# EAGLE board ESP32 Display 2.4 inch V1.0 (EAGLE 9.6.2), part 1 of 2
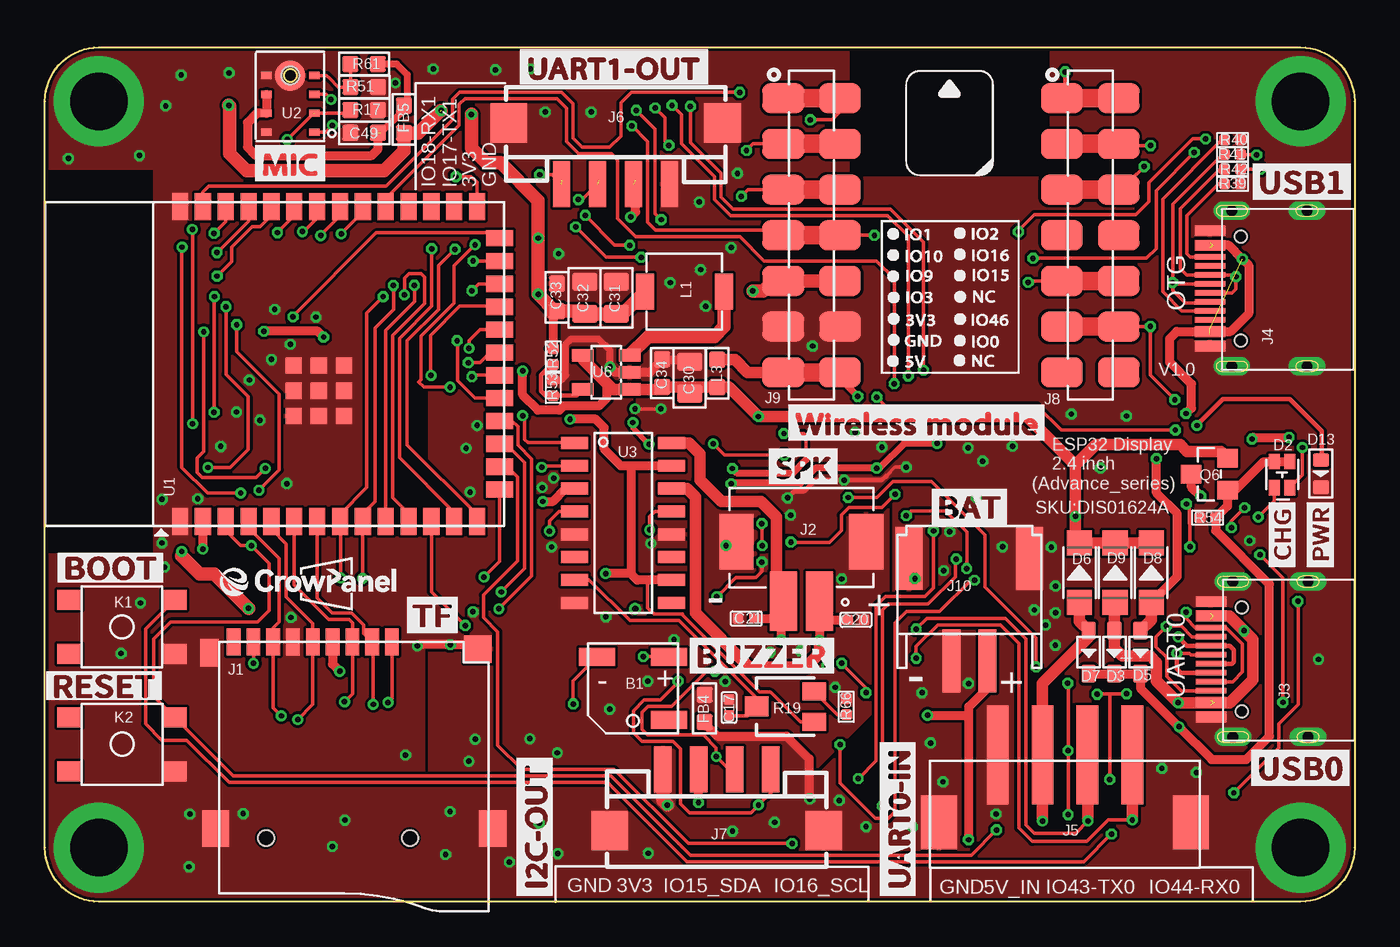
[diagram p5: board, top side]
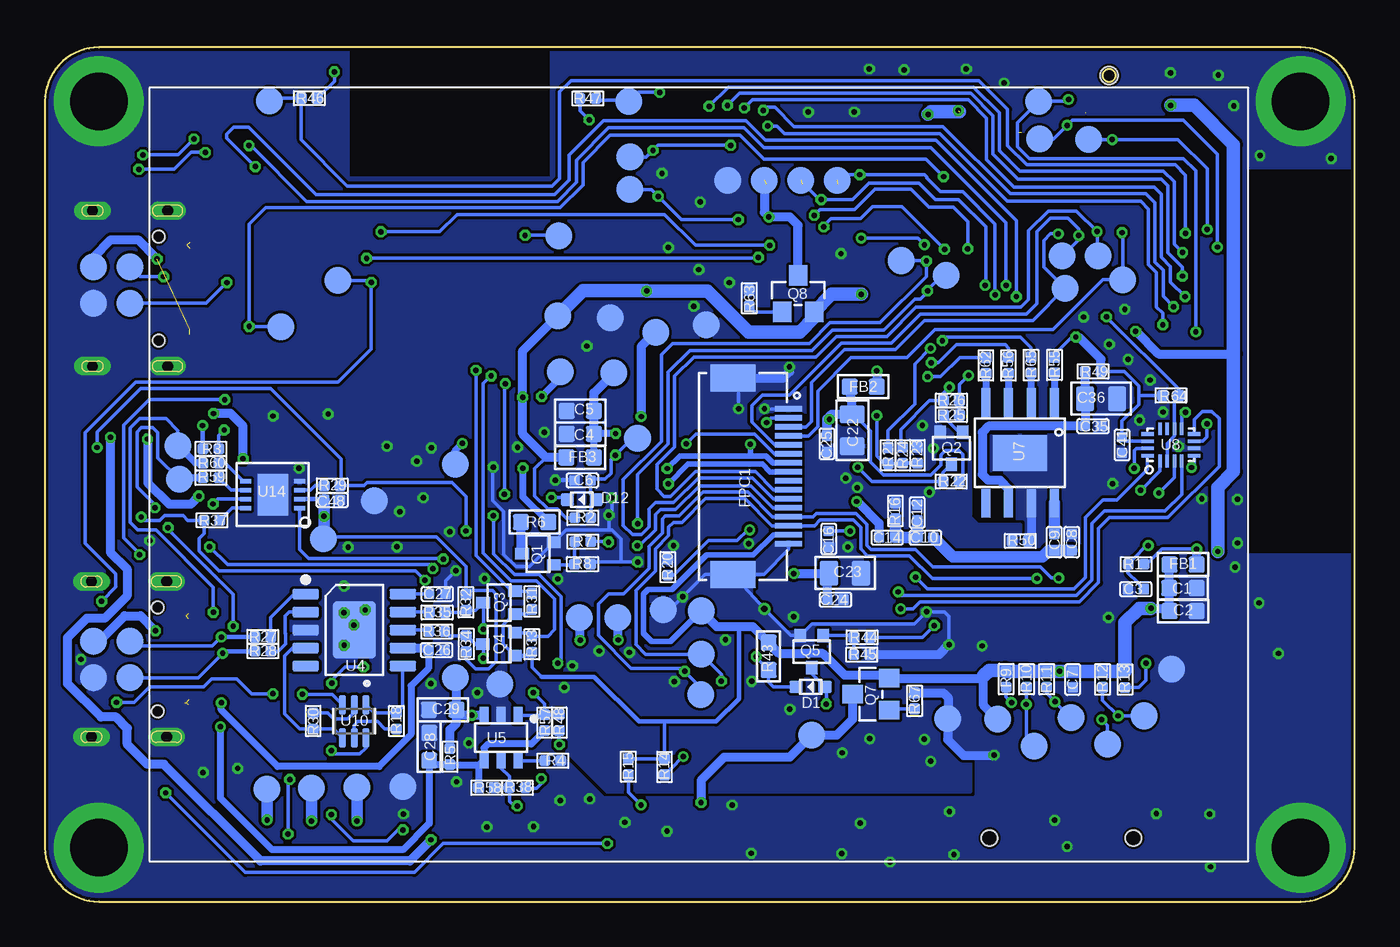
[diagram p6: board, bottom side, seen from below]

Size 72.8 x 47.5 mm. Coordinates in mm from the lower left corner, seen from the top.
Outline: 69.8,0 3,0 arc-90 0,3 0,44.5 arc-90 3,47.5 69.8,47.5 arc-90 72.8,44.5 72.8,3 arc-90 69.8,0
Copper layers (1*16): Top 0.035mm / dielectric 1.5mm / Bottom 0.035mm
Design rules "default": minimum track width 8mil, minimum drill 0.3mm, track to track 6mil, track to pad 6mil, pad to pad 4mil, via to via 6mil, smd to smd 6mil, copper to edge 6mil, drill to drill 4mil, minimum pad ring 6mil, minimum via ring 6mil, stop-mask expansion 4mil, vias tented up to drill 100mil, thermal gap 0mil
tRestrict: area 44.7,40.3 to 55.8,47.4; area 0,19.4 to 6,40.7
bRestrict: area 44.7,40.3 to 55.8,47.4; area 0,19.4 to 6,40.7

## Footprints (pad centres in the part's own frame; a part is rotated, then mirrored left to right if it is on the bottom)
BEEP_5025 = smd 2 x 1: 1 -2,-1.75; 2 2,-1.75; 3 -2,1.75
C0603 = smd 0.889 x 0.889: 1 -0.762,0; 2 0.762,0
C0402 = smd 0.6 x 0.6: 1 -0.45,0; 2 0.45,0
C0805 = smd 1.016 x 1.397: 1 -0.889,0; 2 0.889,0
D_SOD523 = smd 0.762 x 0.7: + -0.8,0; - 0.8,0
LED_KT-0603RYG = smd 0.85 x 0.6: 1 0.725,-0.425; 2 0.725,0.425; 3 -0.725,-0.425; 4 -0.725,0.425
D_SOD323 = smd 1 x 0.8: + -1.2,0; - 1.2,0
D_SOD123FL = smd 1.397 x 1.397: + -1.651,0; - 1.651,0
LED0603 = smd 0.762 x 0.889: + -0.762,0; - 0.762,0
L0603 = smd 0.889 x 0.889: 1 -0.762,0; 2 0.762,0
FPC-0.5MM-16P-SMD = smd 0.3 x 1.5: 1 -3.75,1.55; 2 -3.25,1.55; 3 -2.75,1.55; 4 -2.25,1.55; 5 -1.75,1.55; 6 -1.25,1.55; 7 -0.75,1.55; 8 -0.25,1.55; 9 0.25,1.55; 10 0.75,1.55; 11 1.25,1.55; 12 1.75,1.55; 13 2.25,1.55; 14 2.75,1.55; 15 3.25,1.55; 16 3.75,1.55 | smd 1.5 x 2.5: 17 5.45,-1.55; 18 -5.45,-1.55
9P-SMD-W/-RING = smd 1.524 x 0.762: 1 0,4.4; 2 0,3.3; 3 0,2.2; 4 0,1.1; 5 0,0; 6 0,-1.1; 7 0,-2.2; 8 0,-3.3; 9 0,-4.4 | smd 1.524 x 1.016: G1 0.6,-5.746 | smd 2.032 x 1.524: G2 10.373,-5.4; G3 10.373,10 | smd 1.524 x 1.524: G4 0.392,9.181 | hole 0.889: 10.9,-2.6; 10.9,5.4
CONN-TH_2P-P2.00_XUNPU_WAFER-PH2.0-2PLB = smd 1.5 x 3.3: 1 -1,1.65; 2 1,1.65 | smd 1.9 x 3.1: 3 3.6,-1.65; 4 -3.6,-1.65
USB-3.0TYPEC-SMD = smd 0.3 x 1.7: A1 -3.35,0.5; A4 -2.55,0.5; A5 -1.25,0.5; A6 -0.25,0.5; A7 0.25,0.5; A8 1.25,0.5; A9 2.55,0.5; A12 3.35,0.5; B1 3.05,0.5; B4 2.25,0.5; B5 1.75,0.5; B6 0.75,0.5; B7 -0.75,0.5; B8 -1.75,0.5; B9 -2.25,0.5; B12 -3.05,0.5 | drill 0.6 pad 1.016 long: P$1 -4.325,-0.72; P$2 4.325,-0.72; P$3 -4.325,-4.9; P$4 4.325,-4.9 | hole 0.68: -2.89,-1.22; 2.89,-1.22
XH2.54-4P-SMD = smd 1.2 x 5.5: 1 -3.75,-1.875; 2 -1.25,-1.875; 3 1.25,-1.875; 4 3.75,-1.875 | smd 2 x 3: 5 -7,1.875; 6 7,1.875
CONNECTOR_4P-SMD-2.0 = smd 0.965 x 2.54: 1 -3,0; 2 -1,0; 3 1,0; 4 3,0 | smd 2.032 x 2.184: SS1 -5.946,3.4; SS2 5.946,3.4
H7-2.54-18.28X2.5X5MM = smd 1.65 x 2.3: 1 -7.62,-1.58; 1-1 -7.62,1.58; 2 -5.08,-1.58; 2-2 -5.08,1.58; 3 -2.54,-1.58; 3-3 -2.54,1.58; 4 0,-1.58; 4-4 0,1.58; 5 2.54,-1.58; 5-5 2.54,1.58; 6 5.08,-1.58; 6-6 5.08,1.58; 7 7.62,-1.58; 7-7 7.62,1.58
PH2.0WT-2PIN = smd 1 x 3.5: P$1 -1,0; P$2 1,0 | smd 1.5 x 3.5: P$3 -3.35,-5.7; P$4 3.35,-5.7
THO-M3.2*5MM-HOLE = drill 3.2 pad 5: P$1 0,0
KEY-4.5X4.5-SMD = smd 1.35 x 1.1: 1 -2.925,1.5; 2 -2.925,-1.5; 3 2.925,-1.5; 4 2.925,1.5
L0420 = smd 2 x 1: 1 0,2.2; 2 0,-2.2
TEST_PAD-1.5MM = smd 1.5 x 1.5: P$1 0,0
MOS_SOT323 = smd 0.635 x 0.762: 1 -0.635,-0.889; 2 0.635,-0.889; 3 0,0.889
PMOS_SOT23 = smd 1.016 x 1.143: 1 -0.889,-1.016; 2 0.889,-1.016; 3 0,1.016
R0402 = smd 0.635 x 0.635: 1 -0.445,0; 2 0.445,0
R0603-SP = smd 0.889 x 0.889: 1 -0.762,0; 2 0.762,0
3P-SMD-SQUA-3.6X3.3 = smd 1 x 1.3: 1 -0.85,-1.6; 3 0.85,-1.6 | smd 1.1 x 1.3: 2 0,1.6
ESP32-S3-WROOM-1-SMD41 = smd 1.5 x 0.9: 1 -8.75,5.26; 2 -8.75,3.99; 3 -8.75,2.72; 4 -8.75,1.45; 5 -8.75,0.18; 6 -8.75,-1.09; 7 -8.75,-2.36; 8 -8.75,-3.63; 9 -8.75,-4.9; 10 -8.75,-6.17; 11 -8.75,-7.44; 12 -8.75,-8.71; 13 -8.75,-9.98; 14 -8.75,-11.25; 27 8.75,-11.25; 28 8.75,-9.98; 29 8.75,-8.71; 30 8.75,-7.44; 31 8.75,-6.17; 32 8.75,-4.9; 33 8.75,-3.63; 34 8.75,-2.36; 35 8.75,-1.09; 36 8.75,0.18; 37 8.75,1.45; 38 8.75,2.72; 39 8.75,3.99; 40 8.75,5.26 | smd 0.9 x 1.5: 15 -6.985,-12.5; 16 -5.715,-12.5; 17 -4.445,-12.5; 18 -3.175,-12.5; 19 -1.905,-12.5; 20 -0.635,-12.5; 21 0.635,-12.5; 22 1.905,-12.5; 23 3.175,-12.5; 24 4.445,-12.5; 25 5.715,-12.5; 26 6.985,-12.5 | smd 0.9 x 0.9: 41 -2.9,-1.06; 42 -1.5,-1.06; 43 -0.1,-1.06; 44 -2.9,-2.46; 45 -1.5,-2.46; 46 -0.1,-2.46; 47 -2.9,-3.86; 48 -1.5,-3.86; 49 -0.1,-3.86
ICS_43432_IIS_INMP441 = smd 0.6 x 0.4: 1 1.203,-0.991; 2 1.203,0.059; 3 1.203,1.109; 4 1.203,2.159; 6 -1.457,2.159; 7 -1.457,1.109; 8 -1.457,0.059; 9 -1.457,-0.991 | smd 1.7 x 1.7: 5 -0.127,2.159 | hole 1: -0.127,2.159
SOP-16 = smd 0.66 x 1.5: 1 -4.445,-2.7; 2 -3.175,-2.7; 3 -1.905,-2.7; 4 -0.635,-2.7; 5 0.635,-2.7; 6 1.905,-2.7; 7 3.175,-2.7; 8 4.445,-2.7; 9 4.445,2.7; 10 3.175,2.7; 11 1.905,2.7; 12 0.635,2.7; 13 -0.635,2.7; 14 -1.905,2.7; 15 -3.175,2.7; 16 -4.445,2.7
ESOP-10-EP-150MIL = smd 1.5 x 0.6: 1 -2.7,2; 2 -2.7,1; 3 -2.7,0; 4 -2.7,-1; 5 -2.7,-2; 6 2.7,-2; 7 2.7,-1; 8 2.7,0; 9 2.7,1; 10 2.7,2 | smd 2.4 x 3.2: EP 0,0
SOT23-6L = smd 0.5 x 0.9: 1 -0.961,-1.212; 2 -0.011,-1.212; 3 0.94,-1.212; 4 0.94,1.288; 5 -0.011,1.288; 6 -0.961,1.288
IC_SOT23-5 = smd 0.69 x 1.2: 1 -0.95,-1.3; 2 0,-1.3; 3 0.95,-1.3; 4 0.95,1.3; 5 -0.95,1.3
NS4168-ESOP-8 = smd 1.6 x 0.5: 1 -2.8,1.905; 2 -2.8,0.635; 3 -2.8,-0.635; 4 -2.8,-1.905; 5 2.8,-1.905; 6 2.8,-0.635; 7 2.8,0.635; 8 2.8,1.905 | smd 2 x 3: 9 0,0
IC_SGM3799_TQFN2.6X1.8_16L = smd 0.2 x 0.7: 1 -0.6,-0.9; 2 -0.2,-0.9; 3 0.2,-0.9; 4 0.6,-0.9; 9 0.6,0.9; 10 0.2,0.9; 11 -0.2,0.9; 12 -0.6,0.9 | smd 0.7 x 0.2: 5 1.3,-0.6; 6 1.3,-0.2; 7 1.3,0.2; 8 1.3,0.6; 13 -1.3,0.6; 14 -1.3,0.2; 15 -1.3,-0.2; 16 -1.3,-0.6
SOP65P210X100-6N = smd 1.09 x 0.4: 1 -0.92,0.65; 2 -0.92,0; 3 -0.92,-0.65; 4 0.92,-0.65; 5 0.92,0; 6 0.92,0.65
DFN8 = smd 0.61 x 0.25: 1 -1.5,0.75; 2 -1.5,0.25; 3 -1.5,-0.25; 4 -1.5,-0.75; 5 1.5,-0.75; 6 1.5,-0.25; 7 1.5,0.25; 8 1.5,0.75 | smd 1.7 x 2.3: P$9 0,0

## Placement (x,y rotation side)
B1  BEEP_5025  [BEEP_5025]  32.69,11.85 180 top
C1  10uF/0603  [C0603]  9.54,17.44 180 bottom
C2  100nF/0603  [C0603]  9.53,16.15 180 bottom
C3  1uF  [C0402]  12.16,17.37 0 bottom
C4  100nF/0603  [C0603]  43.04,26 0 bottom
C5  100nF/0603  [C0603]  43.04,27.28 0 bottom
C6  1uF  [C0402]  42.92,23.42 0 bottom
C7  1uF  [C0402]  15.67,12.35 90 bottom
C8  1nF  [C0402]  15.72,19.99 270 bottom
C9  10uF  [C0402]  16.69,19.98 270 bottom
C10  1uF  [C0402]  23.85,20.24 0 bottom
C12  100nF/NC  [C0402]  24.31,21.63 270 bottom
C14  100nF  [C0402]  25.98,20.24 0 bottom
C16  4.7uF  [C0402]  29.23,20.16 90 bottom
C17  100nF  [C0402]  38.03,10.79 270 top
C20  1nF  [C0402]  45.09,15.67 180 top
C21  1nF  [C0402]  38.98,15.74 0 top
C22  22uF/0805  [C0805]  27.92,26.21 90 bottom
C23  22uF/0805  [C0805]  28.32,18.27 180 bottom
C24  100nF  [C0402]  28.86,16.79 0 bottom
C25  100nF  [C0402]  29.33,25.45 270 bottom
C26  1uF  [C0402]  51.03,13.98 180 bottom
C27  1uF  [C0402]  50.99,17.1 180 bottom
C28  1uF/0603  [C0603]  51.44,8.62 270 bottom
C29  10uF/0603  [C0603]  50.69,10.67 0 bottom
C30  22uF/0805  [C0805]  35.84,29.13 270 top
C31  22uF/0805  [C0805]  31.77,33.56 270 top
C32  22uF/0805  [C0805]  30,33.56 270 top
C33  1uF/0603  [C0603]  28.46,33.59 270 top
C34  1uF/0603  [C0603]  34.31,29.39 270 top
C35  100nF  [C0402]  14.54,26.44 0 bottom
C36  47uF/0805  [C0805]  14.08,27.96 0 bottom
C41  1uF  [C0402]  12.93,25.39 90 bottom
C48  1uF  [C0402]  56.83,22.33 180 bottom
C49  100nF  [C0603]  17.75,42.74 0 top
D1  B5819WT  [D_SOD523]  30.24,11.94 180 bottom
D2  KT-0603RYG  [LED_KT-0603RYG]  68.77,23.75 90 top
D3  1N5817WS  [D_SOD323]  59.45,13.87 270 top
D5  1N5817WS  [D_SOD323]  60.9,13.87 270 top
D6  DSS34  [D_SOD123FL]  57.51,18.29 90 top
D7  1N5817WS  [D_SOD323]  58.02,13.87 270 top
D8  DSS34  [D_SOD123FL]  61.5,18.29 90 top
D9  DSS34  [D_SOD123FL]  59.49,18.29 90 top
D12  B5819WT  [D_SOD523]  42.96,22.35 180 bottom
D13  Red  [LED0603]  70.93,23.8 270 top
FB1  0R/800mA  [L0603]  9.53,18.74 0 bottom
FB2  0R/600mA  [L0603]  27.32,28.63 180 bottom
FB3  0R/800mA  [L0603]  43.05,24.7 0 bottom
FB4  0R/600mA  [L0603]  36.67,10.75 270 top
FB5  0R/800mA  [L0603]  19.95,43.49 90 top
FPC1  TFT-2.4-SPI-16P  [FPC-0.5MM-16P-SMD]  33.01,23.65 270 bottom
J1  [9P-SMD-W/-RING]  14.89,14.44 270 top
J2  WAFER-PH2.0-2PLB  [CONN-TH_2P-P2.00_XUNPU_WAFER-PH2.0-2PLB]  42.05,18.36 180 top
J3  TYPEC-3.0-16P-SMD  [USB-3.0TYPEC-SMD]  65.32,13.48 90 top
J4  TYPEC-3.0-16P-SMD  [USB-3.0TYPEC-SMD]  65.26,34.09 90 top
J5  XH2.54-4P-SMT  [XH2.54-4P-SMD]  56.7,6.28 180 top
J6  HY2.0-4P-SMT  [CONNECTOR_4P-SMD-2.0]  31.72,39.89 0 top
J7  HY2.0-4P-SMT  [CONNECTOR_4P-SMD-2.0]  37.35,7.35 180 top
J8  [H7-2.54-18.28X2.5X5MM]  58.11,37.05 270 top
J9  [H7-2.54-18.28X2.5X5MM]  42.62,37.05 270 top
J10  PH2.0WT-2PIN  [PH2.0WT-2PIN]  51.39,13.38 180 top
J12  THO-M3.25MM-HOLE  [THO-M3.2*5MM-HOLE]  3,3 0 top
J13  THO-M3.25MM-HOLE  [THO-M3.2*5MM-HOLE]  69.8,3 0 top
J14  THO-M3.25MM-HOLE  [THO-M3.2*5MM-HOLE]  69.8,44.5 0 top
J15  THO-M3.25MM-HOLE  [THO-M3.2*5MM-HOLE]  3,44.5 0 top
K1  KEY-4.5X4.5  [KEY-4.5X4.5-SMD]  4.28,15.27 180 top
K2  KEY-4.5X4.5  [KEY-4.5X4.5-SMD]  4.29,8.75 180 top
L1  4.7uH/3A  [L0420]  35.55,33.92 270 top
L3  NC  [L0603]  37.37,29.37 270 top
P1  TEST_PADPAD-1.5MM  [TEST_PAD-1.5MM]  36.33,16.16 180 bottom
P2  TEST_PADPAD-1.5MM  [TEST_PAD-1.5MM]  36.35,11.51 0 bottom
P3  TEST_PADPAD-1.5MM  [TEST_PAD-1.5MM]  36.31,13.75 0 bottom
P4  TEST_PADPAD-1.5MM  [TEST_PAD-1.5MM]  22.71,34.82 0 bottom
P5  TEST_PADPAD-1.5MM  [TEST_PAD-1.5MM]  25.2,35.64 0 bottom
P6  TEST_PADPAD-1.5MM  [TEST_PAD-1.5MM]  38.43,16.23 180 bottom
P7  TEST_PADPAD-1.5MM  [TEST_PAD-1.5MM]  41.18,29.39 0 bottom
P8  TEST_PADPAD-1.5MM  [TEST_PAD-1.5MM]  39.86,25.75 0 bottom
P9  TEST_PADPAD-1.5MM  [TEST_PAD-1.5MM]  12.88,34.58 180 bottom
P10  TEST_PADPAD-1.5MM  [TEST_PAD-1.5MM]  14.26,35.91 0 bottom
P11  TEST_PADPAD-1.5MM  [TEST_PAD-1.5MM]  16.25,35.9 0 bottom
P12  TEST_PADPAD-1.5MM  [TEST_PAD-1.5MM]  16.1,34.11 0 bottom
P13  TEST_PADPAD-1.5MM  [TEST_PAD-1.5MM]  44.24,37.03 0 bottom
P14  TEST_PADPAD-1.5MM  [TEST_PAD-1.5MM]  40.3,39.59 0 bottom
P15  TEST_PADPAD-1.5MM  [TEST_PAD-1.5MM]  50,24.32 0 bottom
P16  TEST_PADPAD-1.5MM  [TEST_PAD-1.5MM]  30.18,9.25 0 bottom
P17  TEST_PADPAD-1.5MM  [TEST_PAD-1.5MM]  19.83,10.14 0 bottom
P18  TEST_PADPAD-1.5MM  [TEST_PAD-1.5MM]  40.97,15.8 0 bottom
P19  TEST_PADPAD-1.5MM  [TEST_PAD-1.5MM]  17.8,8.66 0 bottom
P20  TEST_PADPAD-1.5MM  [TEST_PAD-1.5MM]  15.77,10.23 0 bottom
P21  TEST_PADPAD-1.5MM  [TEST_PAD-1.5MM]  13.74,8.76 0 bottom
P22  TEST_PADPAD-1.5MM  [TEST_PAD-1.5MM]  11.7,10.33 0 bottom
P23  TEST_PADPAD-1.5MM  [TEST_PAD-1.5MM]  40.28,41.39 0 bottom
P24  TEST_PADPAD-1.5MM  [TEST_PAD-1.5MM]  10.18,12.92 0 bottom
P25  TEST_PADPAD-1.5MM  [TEST_PAD-1.5MM]  65.34,23.49 0 bottom
P26  TEST_PADPAD-1.5MM  [TEST_PAD-1.5MM]  14.78,42.37 0 bottom
P27  TEST_PADPAD-1.5MM  [TEST_PAD-1.5MM]  17.52,42.4 0 bottom
P28  TEST_PADPAD-1.5MM  [TEST_PAD-1.5MM]  22.61,10.18 90 bottom
P29  TEST_PADPAD-1.5MM  [TEST_PAD-1.5MM]  17.55,44.49 0 bottom
P30  TEST_PADPAD-1.5MM  [TEST_PAD-1.5MM]  43.1,15.79 0 bottom
P31  TEST_PADPAD-1.5MM  [TEST_PAD-1.5MM]  59.69,31.97 180 bottom
P32  TEST_PADPAD-1.5MM  [TEST_PAD-1.5MM]  56.53,34.54 180 bottom
P36  TEST_PADPAD-1.5MM  [TEST_PAD-1.5MM]  32.81,40.11 0 bottom
P37  TEST_PADPAD-1.5MM  [TEST_PAD-1.5MM]  34.85,40.11 0 bottom
P38  TEST_PADPAD-1.5MM  [TEST_PAD-1.5MM]  30.78,40.11 0 bottom
P39  TEST_PADPAD-1.5MM  [TEST_PAD-1.5MM]  28.75,40.11 0 bottom
P40  TEST_PADPAD-1.5MM  [TEST_PAD-1.5MM]  55.45,6.36 0 bottom
P41  TEST_PADPAD-1.5MM  [TEST_PAD-1.5MM]  52.91,6.39 0 bottom
P42  TEST_PADPAD-1.5MM  [TEST_PAD-1.5MM]  57.99,6.33 0 bottom
P43  TEST_PADPAD-1.5MM  [TEST_PAD-1.5MM]  60.47,6.26 0 bottom
P44  TEST_PADPAD-1.5MM  [TEST_PAD-1.5MM]  70.1,35.31 0 bottom
P45  TEST_PADPAD-1.5MM  [TEST_PAD-1.5MM]  68.07,33.27 0 bottom
P46  TEST_PADPAD-1.5MM  [TEST_PAD-1.5MM]  68.07,35.31 0 bottom
P47  TEST_PADPAD-1.5MM  [TEST_PAD-1.5MM]  70.1,33.27 0 bottom
P48  TEST_PADPAD-1.5MM  [TEST_PAD-1.5MM]  70.1,14.48 0 bottom
P49  TEST_PADPAD-1.5MM  [TEST_PAD-1.5MM]  68.07,14.48 0 bottom
P50  TEST_PADPAD-1.5MM  [TEST_PAD-1.5MM]  68.07,12.45 0 bottom
P51  TEST_PADPAD-1.5MM  [TEST_PAD-1.5MM]  70.1,12.45 0 bottom
P52  TEST_PADPAD-1.5MM  [TEST_PAD-1.5MM]  49.99,12.46 0 bottom
P53  TEST_PADPAD-1.5MM  [TEST_PAD-1.5MM]  47.52,12.09 0 bottom
P54  TEST_PADPAD-1.5MM  [TEST_PAD-1.5MM]  38.86,31.65 270 bottom
P55  TEST_PADPAD-1.5MM  [TEST_PAD-1.5MM]  36.04,32.07 270 bottom
P58  TEST_PADPAD-1.5MM  [TEST_PAD-1.5MM]  60.31,44.53 0 bottom
P59  TEST_PADPAD-1.5MM  [TEST_PAD-1.5MM]  40.34,44.5 0 bottom
P60  TEST_PADPAD-1.5MM  [TEST_PAD-1.5MM]  41.36,32.46 0 bottom
P61  TEST_PADPAD-1.5MM  [TEST_PAD-1.5MM]  44.28,32.58 0 bottom
P62  TEST_PADPAD-1.5MM  [TEST_PAD-1.5MM]  44.16,29.47 0 bottom
P74  TEST_PADPAD-1.5MM  [TEST_PAD-1.5MM]  57.33,20.19 0 bottom
P78  TEST_PADPAD-1.5MM  [TEST_PAD-1.5MM]  65.41,25.36 0 bottom
P79  TEST_PADPAD-1.5MM  [TEST_PAD-1.5MM]  54.49,22.29 0 bottom
Q1  SS8050W-SOT323  [MOS_SOT323]  45.39,19.36 90 bottom
Q2  BSS138W_SOT323  [MOS_SOT323]  22.41,25.21 180 bottom
Q3  BSS138W_SOT323  [MOS_SOT323]  47.55,16.62 90 bottom
Q4  BSS138W_SOT323  [MOS_SOT323]  47.56,14.31 90 bottom
Q5  SS8050W-SOT323  [MOS_SOT323]  30.17,13.9 180 bottom
Q6  AO3401  [PMOS_SOT23]  64.72,23.77 90 top
Q7  AO3401  [PMOS_SOT23]  26.89,11.53 90 bottom
Q8  AO3401  [PMOS_SOT23]  30.93,33.81 0 bottom
R1  10K  [R0402]  12.15,18.76 0 bottom
R2  10K  [R0402]  42.9,21.34 180 bottom
R3  5.1K 1%  [R0402]  63.58,25.18 0 bottom
R4  2K  [R0402]  44.57,7.84 180 bottom
R5  5.1K  [R0402]  50.29,8.06 270 bottom
R6  8.2R/0603  [R0603-SP]  45.58,21.1 0 bottom
R7  1K  [R0402]  42.9,20.01 0 bottom
R8  47K  [R0402]  42.92,18.77 0 bottom
R9  10K  [R0402]  19.37,12.37 90 bottom
R10  10K  [R0402]  18.23,12.37 90 bottom
R11  10K  [R0402]  17.11,12.37 90 bottom
R12  10K  [R0402]  14.01,12.36 90 bottom
R13  10K  [R0402]  12.76,12.35 90 bottom
R14  4.7k  [R0402]  38.36,7.49 90 bottom
R15  4.7k  [R0402]  40.37,7.5 90 bottom
R16  4.7k  [R0402]  25.52,21.72 270 bottom
R17  4.7K  [R0603-SP]  17.75,44.01 0 top
R18  10K  [R0402]  53.26,10.04 90 bottom
R19  10K  [3P-SMD-SQUA-3.6X3.3]  41.16,10.85 90 top
R20  47K  [R0402]  38.18,18.6 270 bottom
R21  1K  [R0402]  25.93,24.81 90 bottom
R22  10K  [R0402]  22.43,23.36 0 bottom
R23  NC  [R0402]  24.3,24.82 270 bottom
R24  10K  [R0402]  25.12,24.82 90 bottom
R25  1K  [R0402]  22.41,27.06 0 bottom
R26  10K  [R0402]  22.41,27.86 180 bottom
R27  0R  [R0402]  60.69,14.72 180 bottom
R28  0R  [R0402]  60.69,13.93 180 bottom
R29  2K  [R0402]  56.83,23.13 0 bottom
R30  10K  [R0402]  57.89,10.04 270 bottom
R31  4.7k  [R0402]  45.73,16.69 270 bottom
R32  4.7k  [R0402]  49.4,16.64 90 bottom
R33  4.7k  [R0402]  45.73,14.31 270 bottom
R34  4.7k  [R0402]  49.38,14.33 270 bottom
R35  0R  [R0402]  51,16.08 180 bottom
R36  0R  [R0402]  51.02,15.02 180 bottom
R37  5.1K  [R0402]  63.52,21.21 180 bottom
R38  NC  [R0402]  46.54,6.33 0 bottom
R39  5.1K  [R0402]  66.02,39.91 180 top
R40  5.1K  [R0402]  66.02,42.35 180 top
R41  0R  [R0402]  66.02,41.54 180 top
R42  0R  [R0402]  66.02,40.73 180 top
R43  3.9R/0603  [R0603-SP]  32.57,13.64 90 bottom
R44  1K  [R0402]  27.38,14.69 0 bottom
R45  47K  [R0402]  27.39,13.74 0 bottom
R46  0R  [R0402]  58.11,44.67 180 bottom
R47  0R  [R0402]  42.62,44.66 0 bottom
R48  NC  [R0402]  44.22,9.96 270 bottom
R49  0R  [R0402]  14.54,29.48 180 bottom
R50  0R  [R0402]  18.59,20.05 0 bottom
R51  0R  [R0603-SP]  17.75,45.3 180 top
R52  45.3K  [R0402]  28.26,30.31 90 top
R53  10K  [R0402]  28.25,28.57 270 top
R54  10K 1%  [R0402]  64.64,21.35 0 top
R55  100k  [R0402]  16.68,29.84 90 bottom
R56  0R  [R0402]  19.24,29.82 90 bottom
R57  5.1K  [R0402]  45.02,9.95 90 bottom
R58  5.1K  [R0402]  48.25,6.33 0 bottom
R59  0R  [R0402]  63.58,23.57 0 bottom
R60  0R  [R0402]  63.58,24.38 0 bottom
R61  NC/0R  [R0603-SP]  17.74,46.57 0 top
R62  0R  [R0402]  20.49,29.81 90 bottom
R63  10K  [R0402]  33.64,33.55 270 bottom
R64  10K  [R0402]  10.21,28.14 180 bottom
R65  0R  [R0402]  17.98,29.83 90 bottom
R66  2k  [R0402]  44.55,10.84 90 top
R67  10K  [R0402]  24.46,11.16 270 bottom
U1  ESP32-S3-WROOM-1  [ESP32-S3-WROOM-1-SMD41]  12.77,29.9 90 top
U2  ICS_43432_IIS_INMP441  [ICS_43432_IIS_INMP441]  13.77,43.77 0 top
U3  NS4268-SOP16  [SOP-16]  32.14,21.06 270 top
U4  CH340K  [ESOP-10-EP-150MIL]  55.61,15.1 0 bottom
U5  TP4059-SOT23-6  [SOT23-6L]  47.45,9.15 180 bottom
U6  RY3420  [IC_SOT23-5]  31.2,29.43 90 top
U7  NS4168-ESOP-8  [NS4168-ESOP-8]  18.6,24.95 270 bottom
U8  SGM3799  [IC_SGM3799_TQFN2.6X1.8_16L]  10.21,25.4 0 bottom
U10  UMH3NTN  [SOP65P210X100-6N]  55.61,10.03 270 bottom
U14  STC8G1K08  [DFN8]  60.14,22.63 180 bottom